# Altium schematic sheet Sheet1.SchDoc
size 1473 x 381 mm
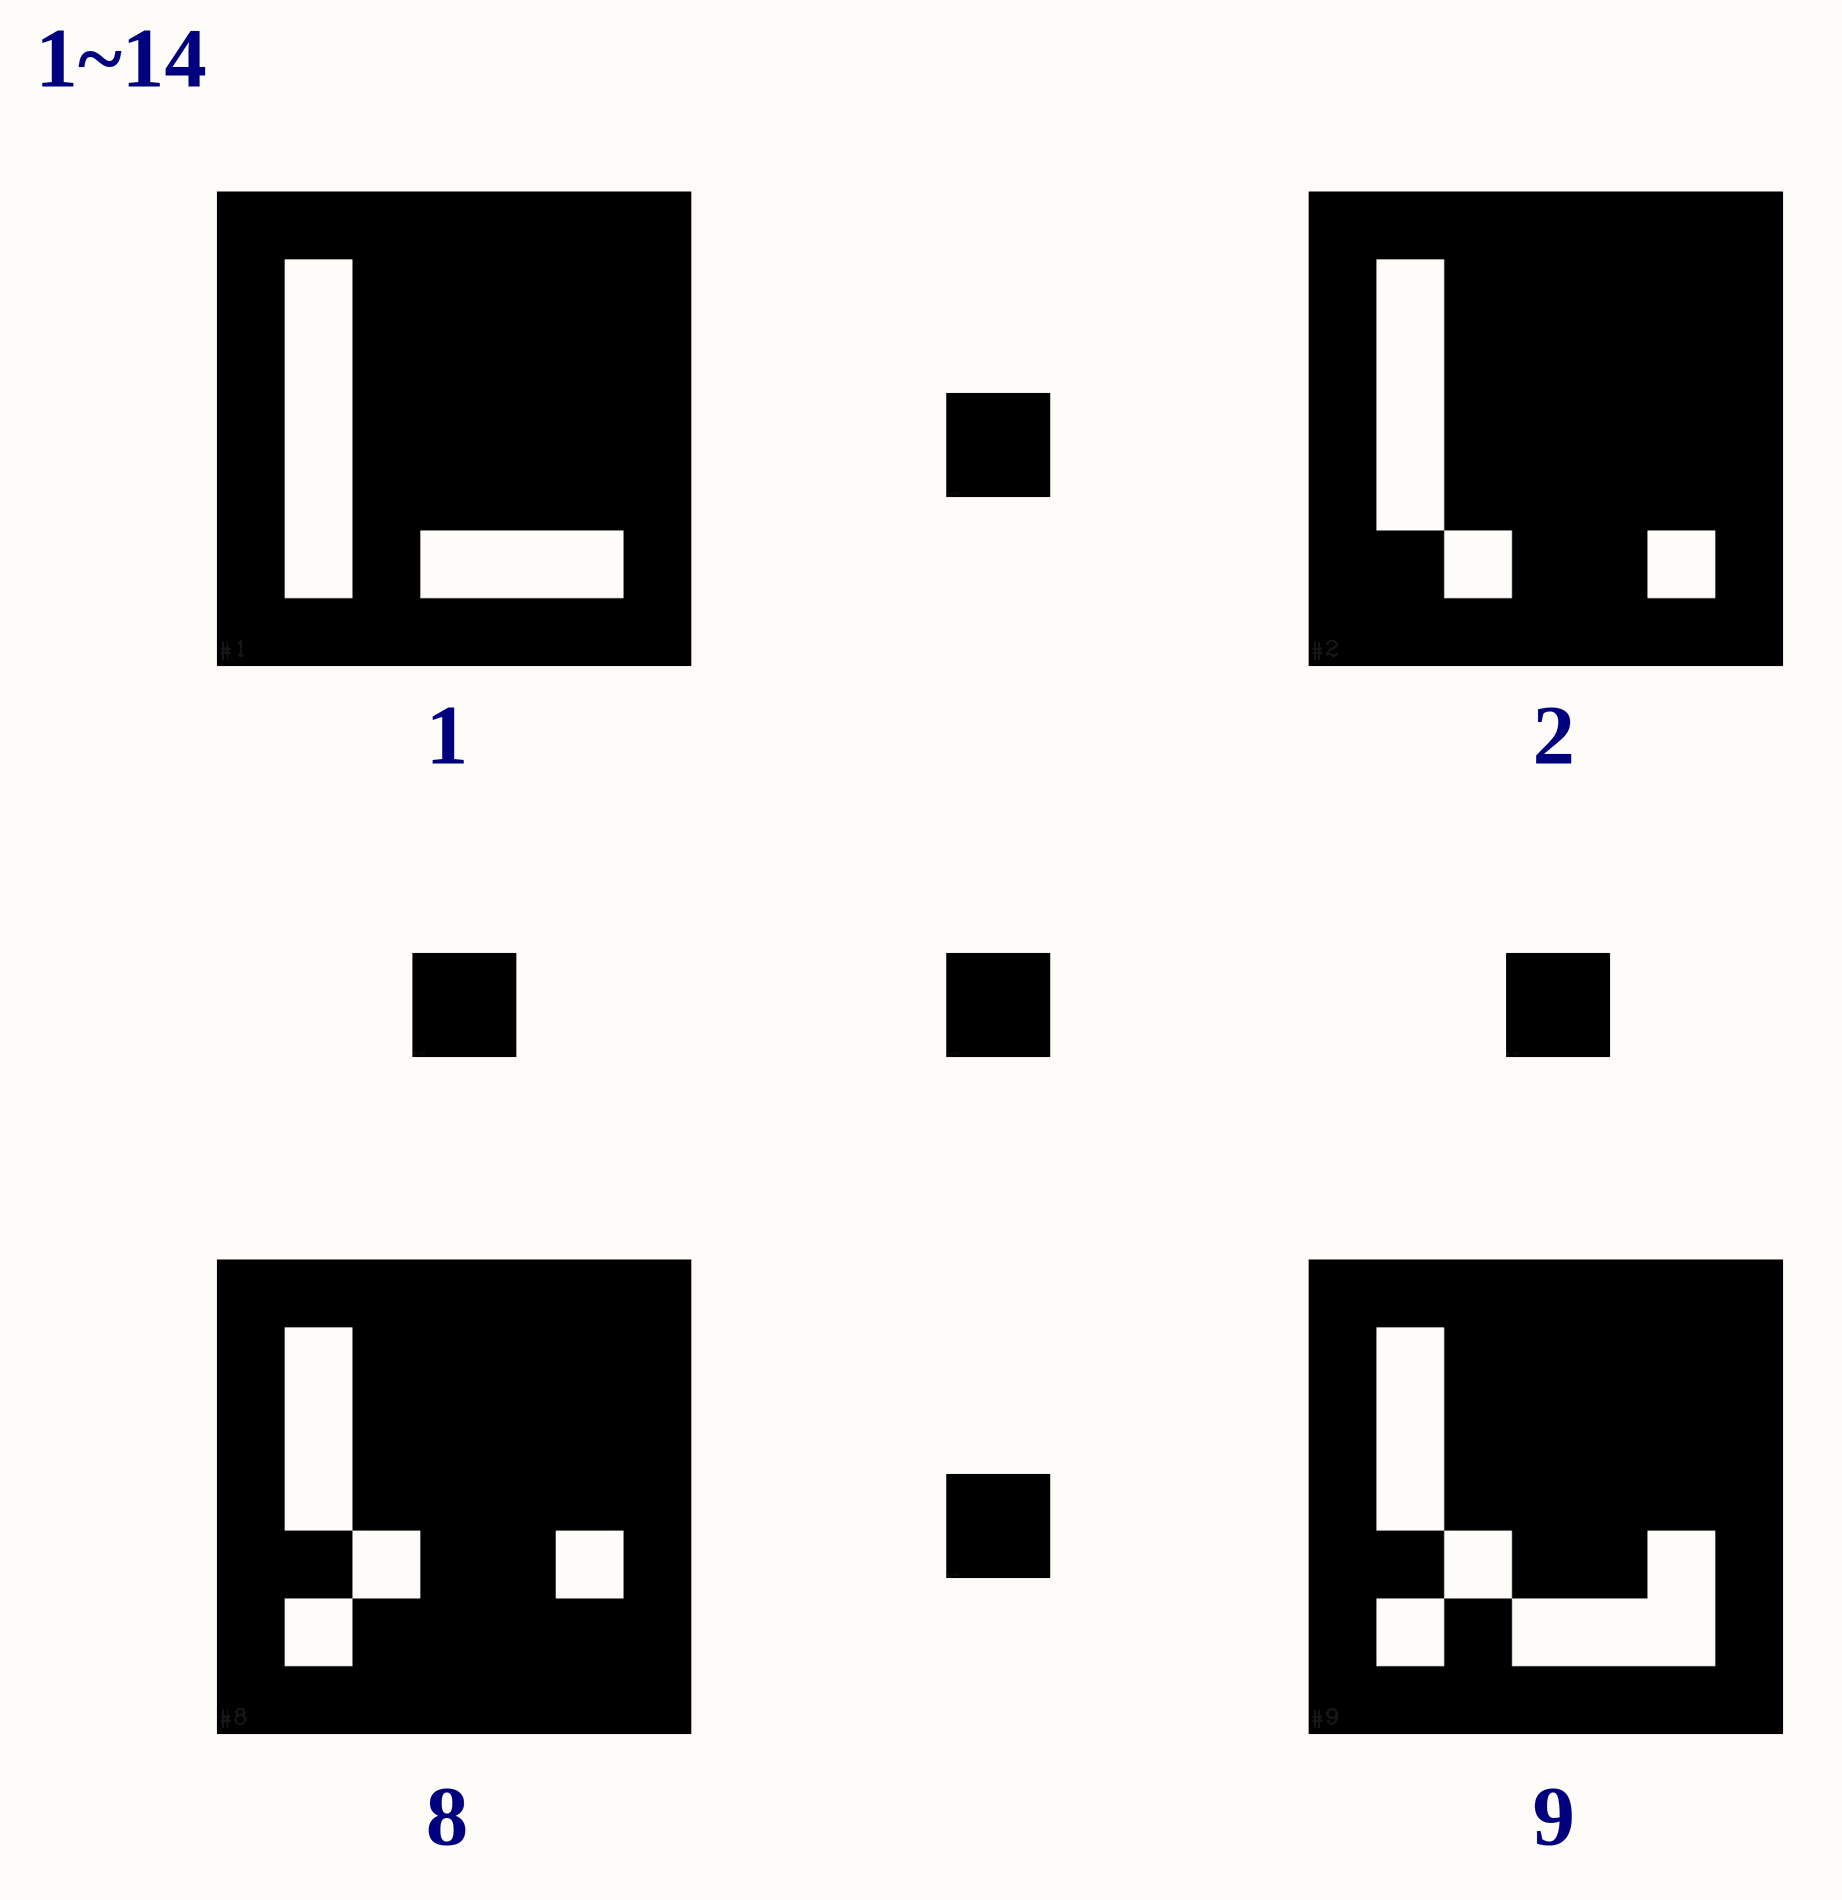
[diagram p0: Sheet1.SchDoc, column 1 of 4]
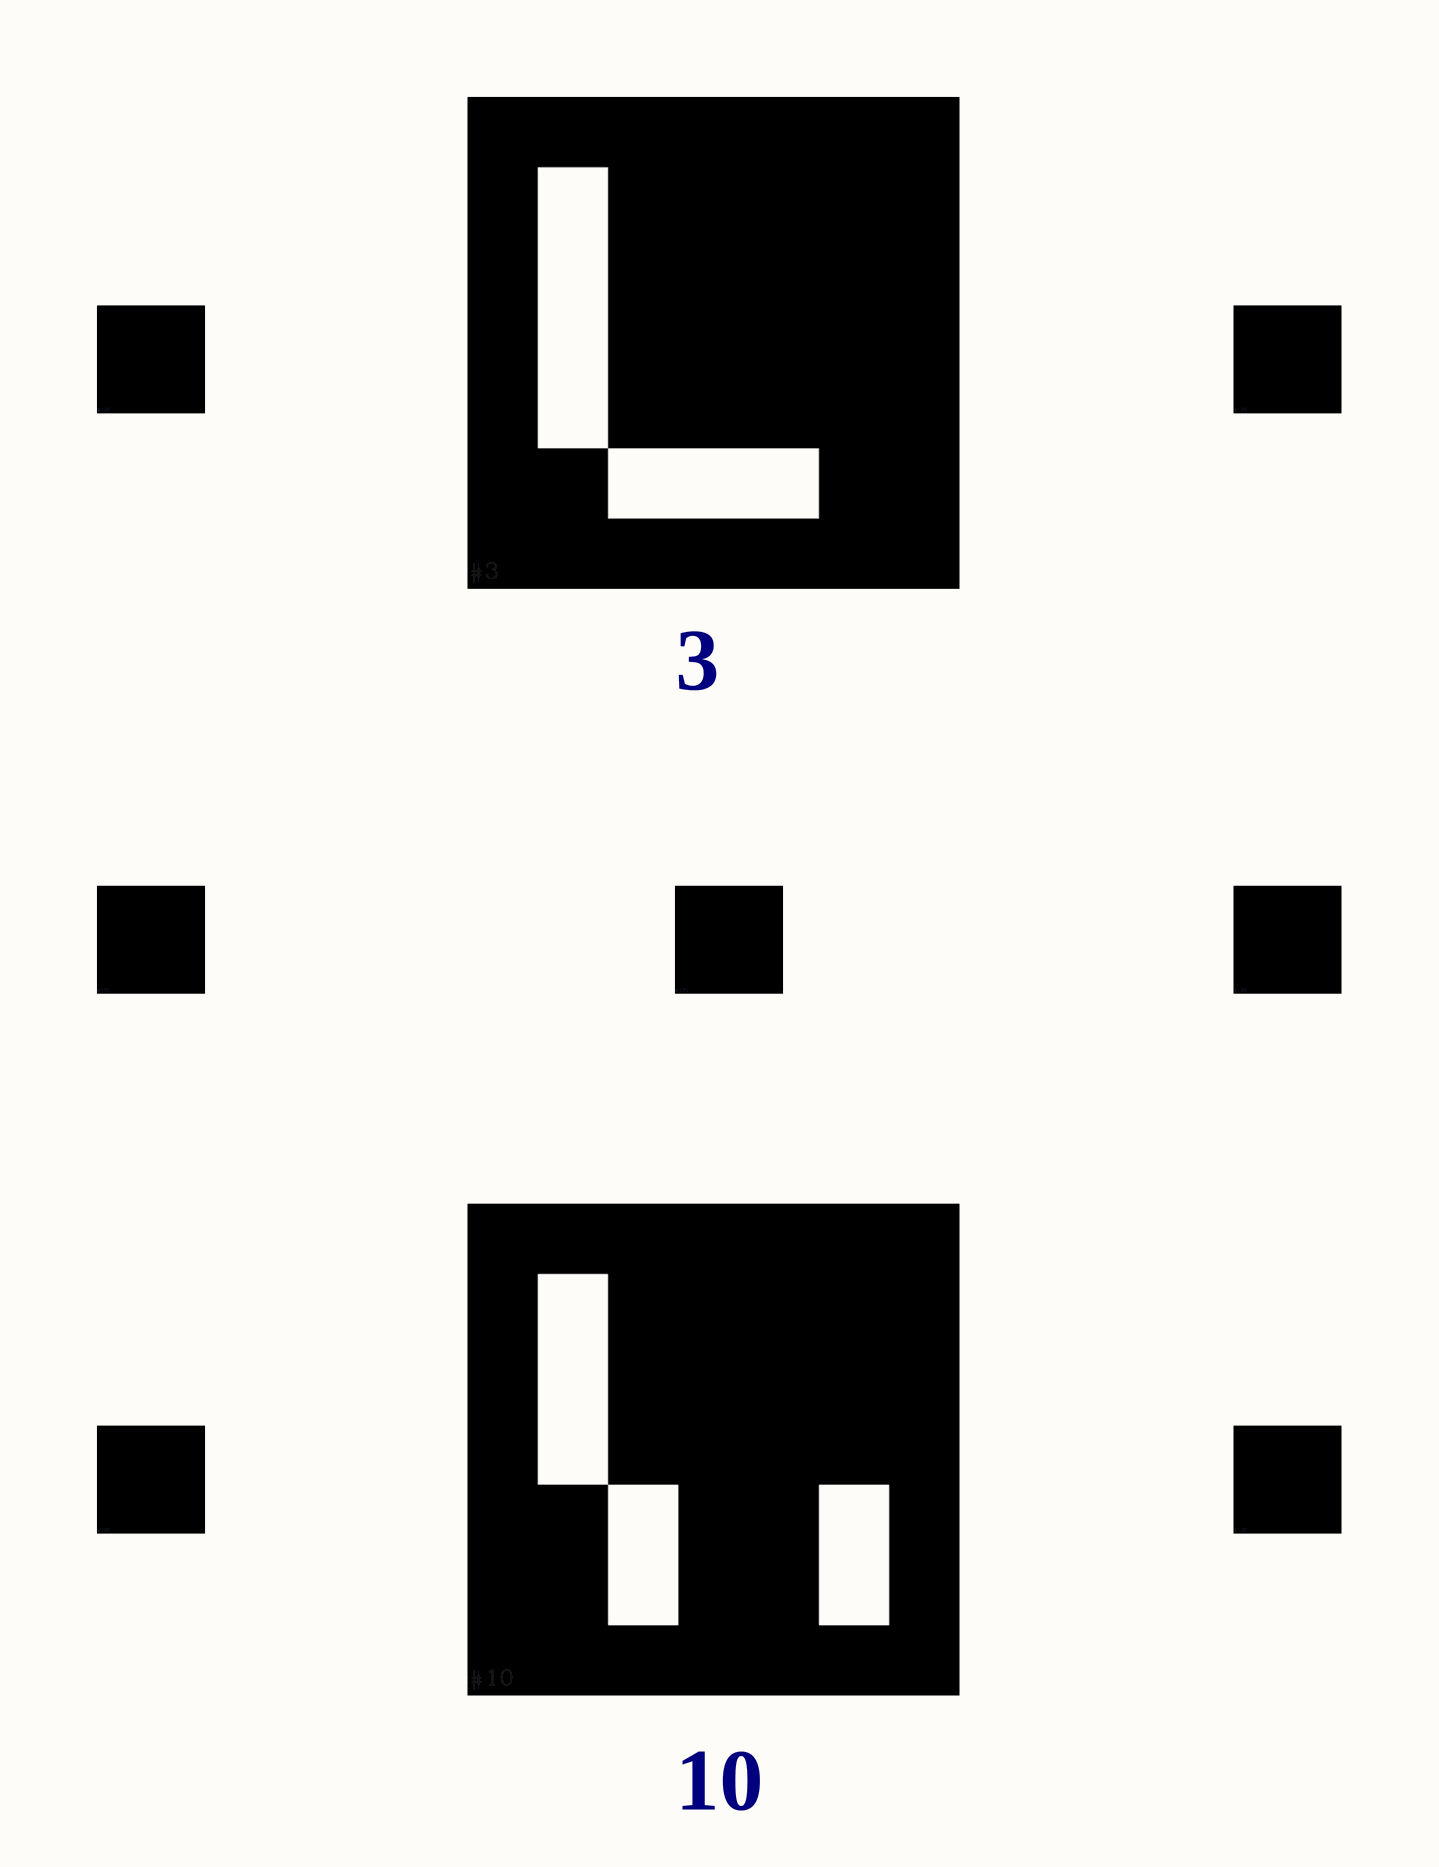
[diagram p1: Sheet1.SchDoc, column 2 of 4]
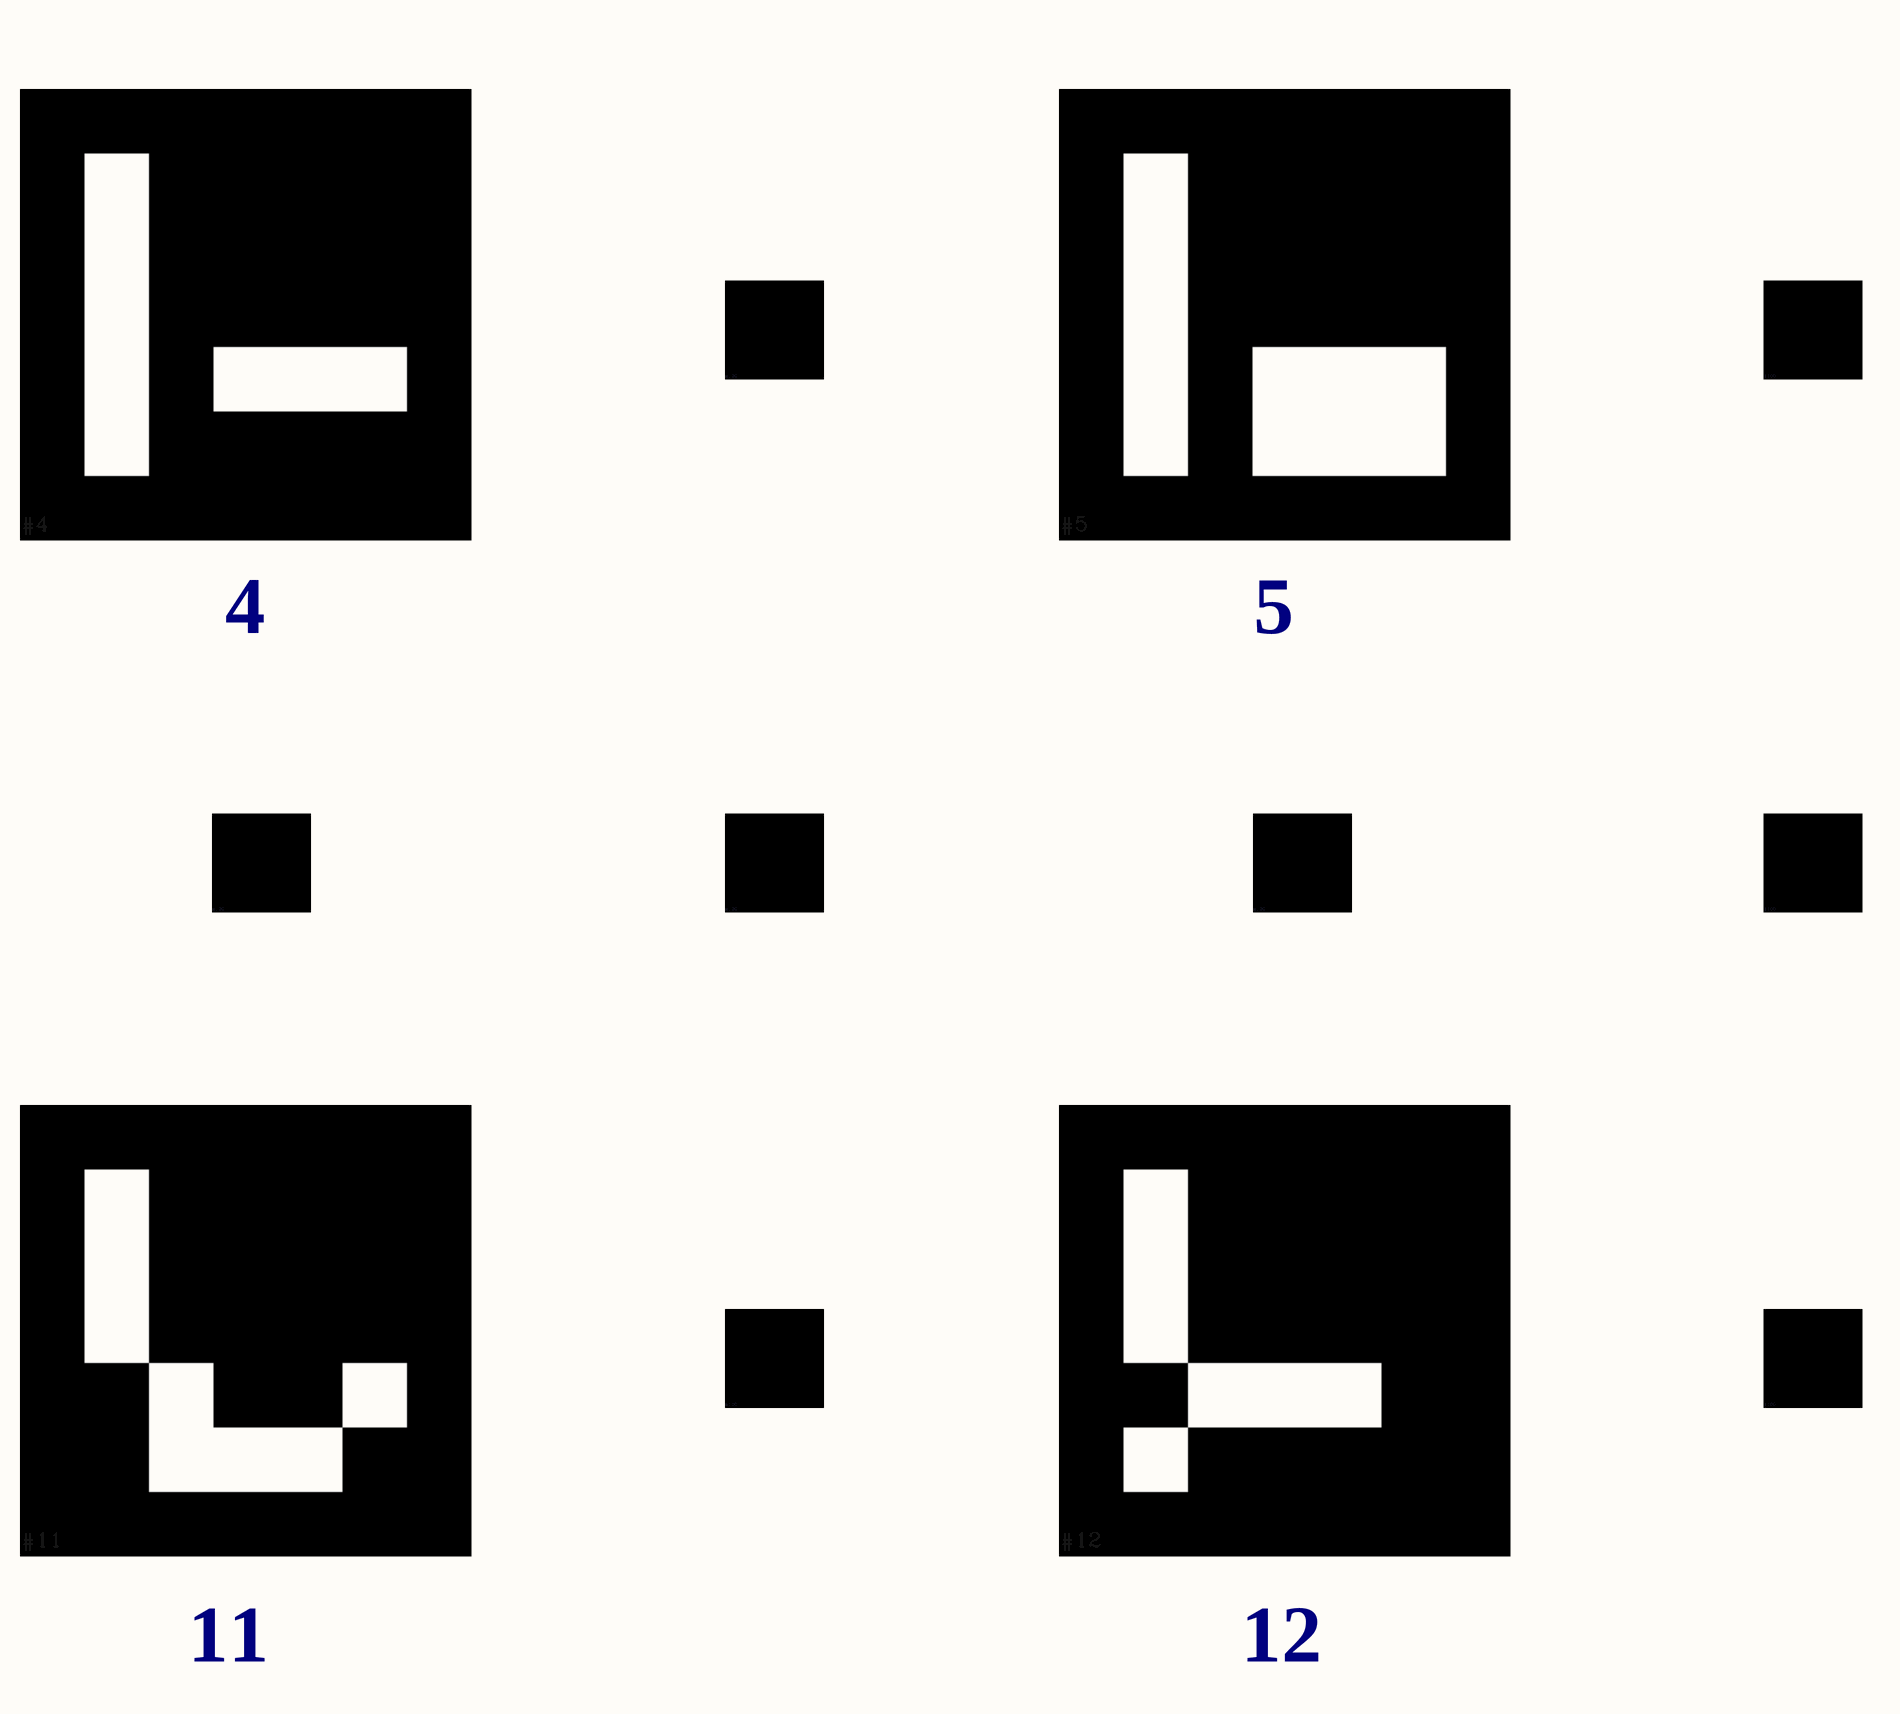
[diagram p2: Sheet1.SchDoc, column 3 of 4]
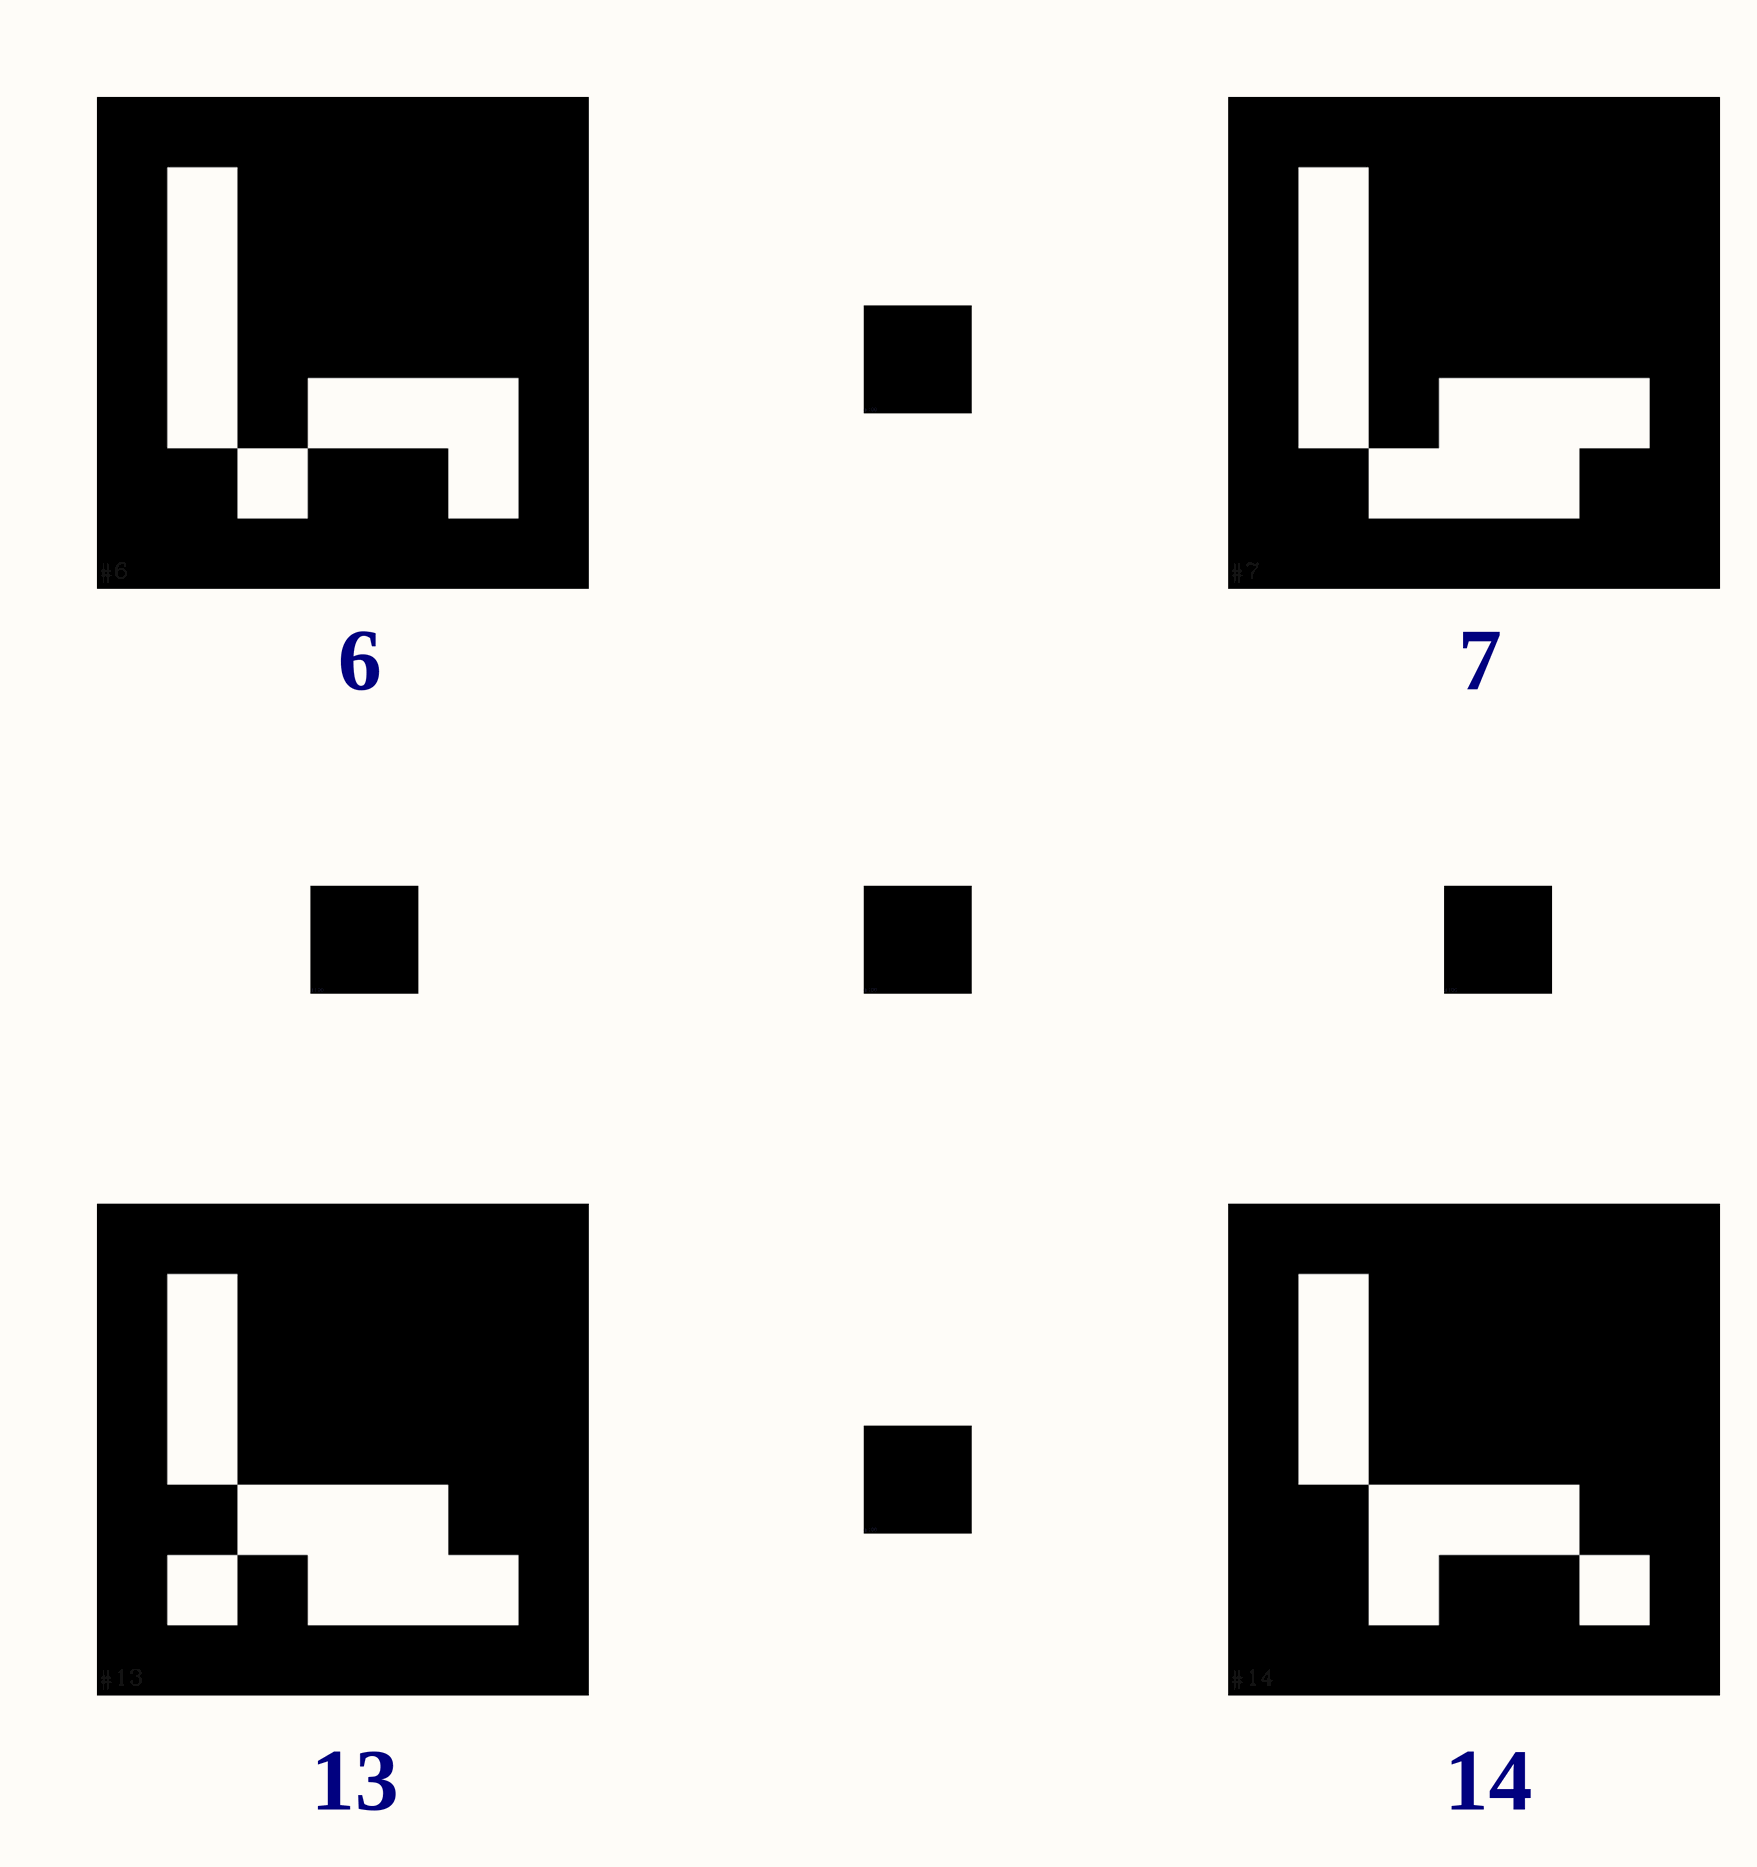
[diagram p3: Sheet1.SchDoc, column 4 of 4]

## Notes on the sheet
- 1~14
- 1
- 2
- 3
- 4
- 5
- 6
- 7
- 8
- 9
- 10
- 11
- 12
- 13
- 14